# EAGLE design RGB_Station_v12 (EAGLE 8.7.0)
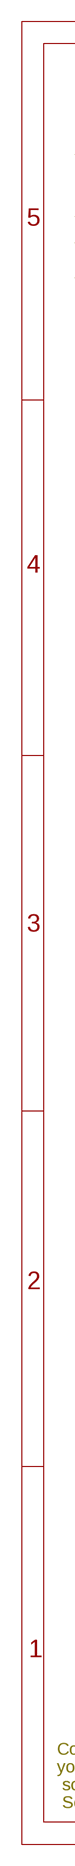
[diagram p0: schematic, sheet 1, part 1 of 2]
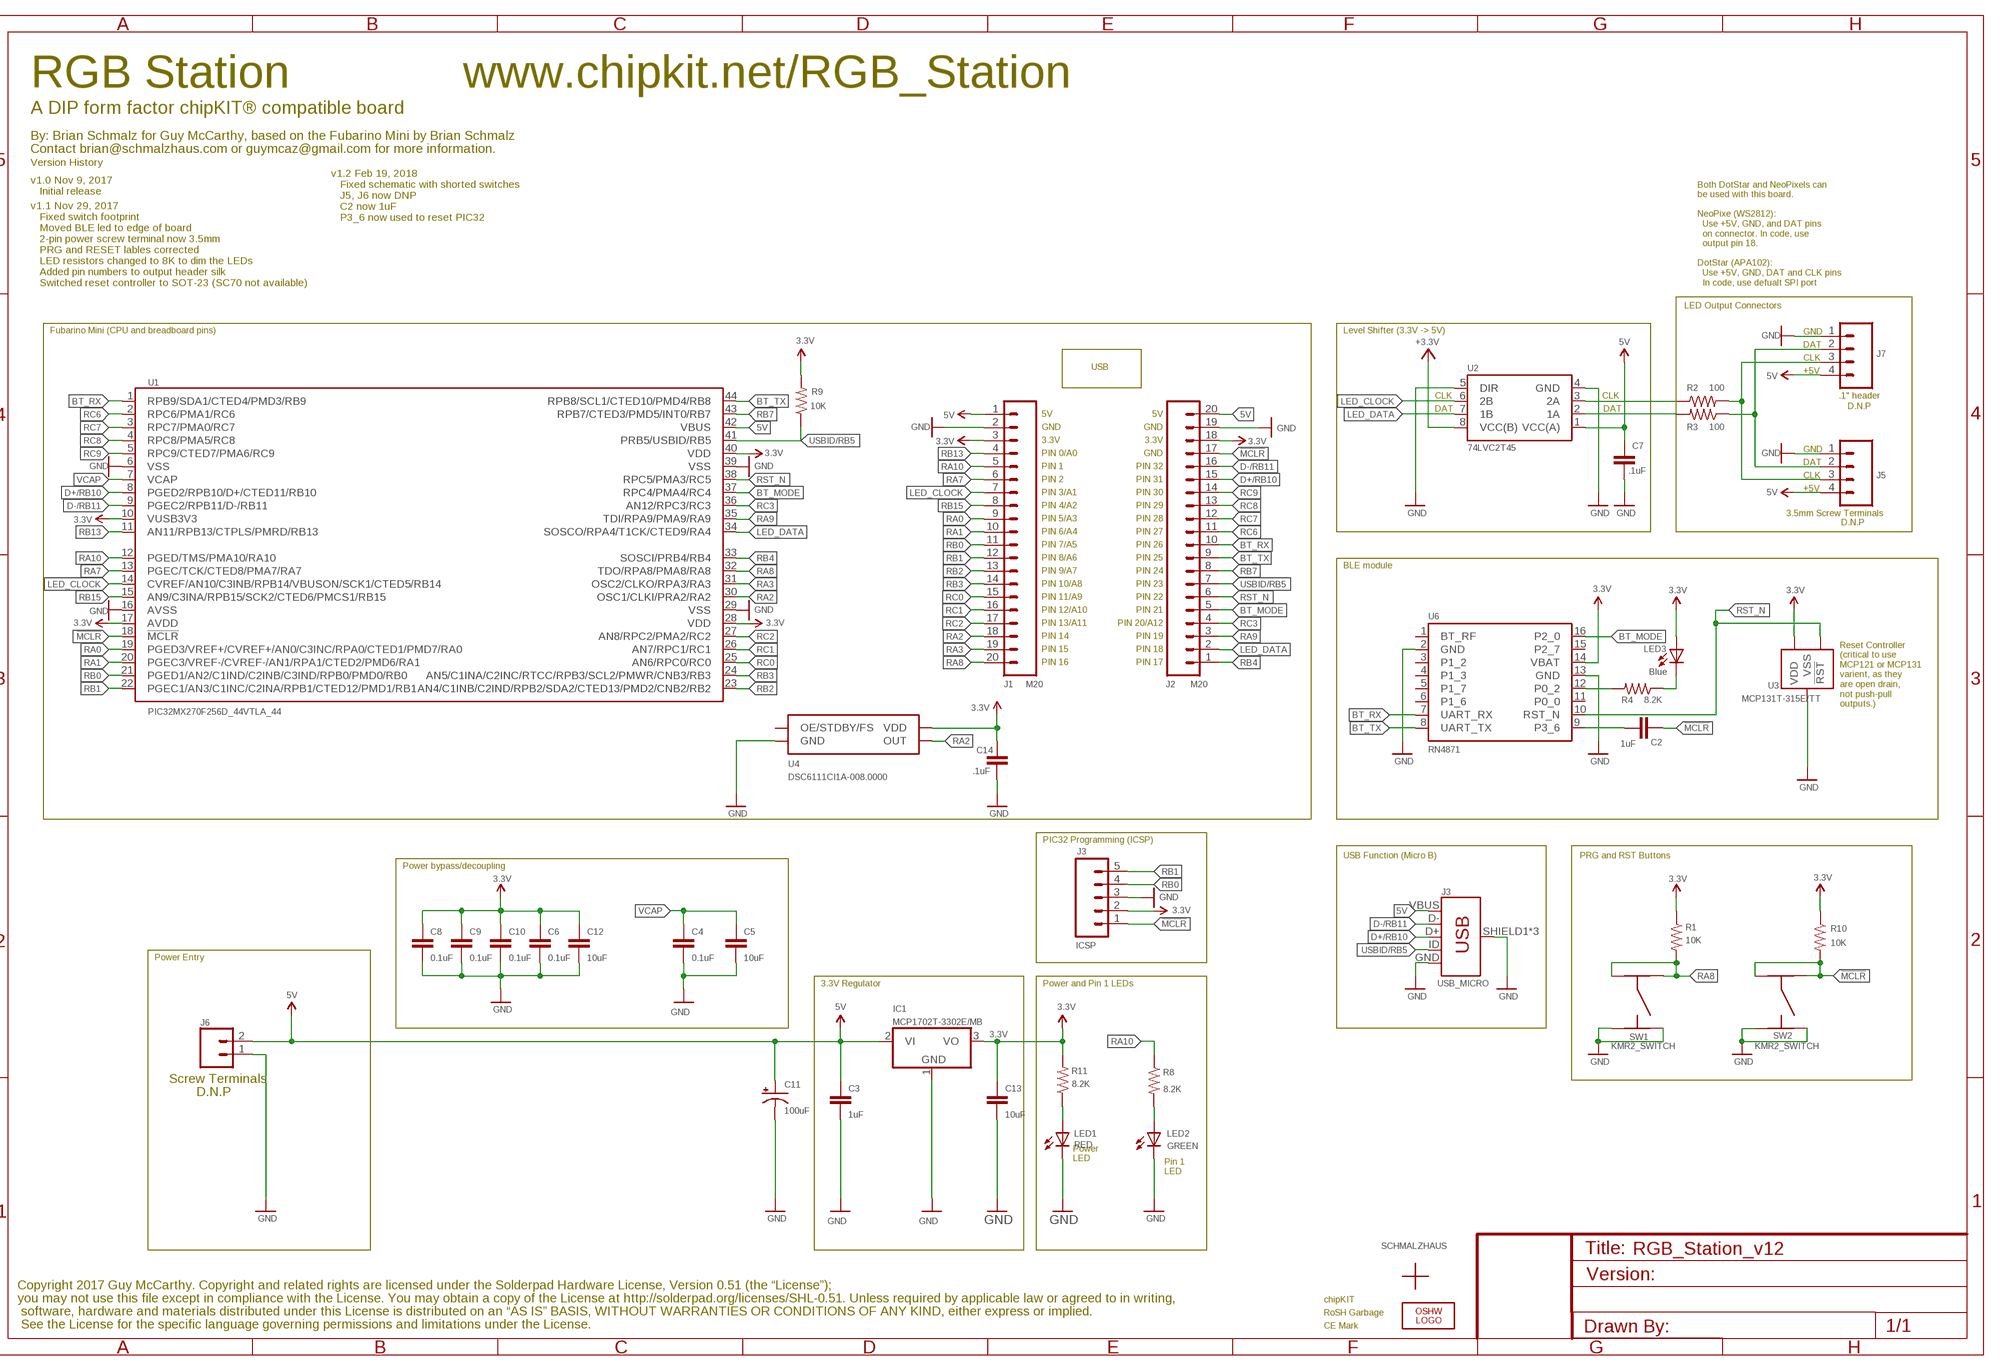
[diagram p1: schematic, sheet 1, part 2 of 2]

## Parts
C2  1uF  CAP0603-CAP  [0603-CAP]
C3  1uF  CAP0603-CAP  [0603-CAP]
C4  0.1uF  CAP0603-CAP  [0603-CAP]
C5  10uF  CAP0805  [0805]
C6  0.1uF  CAP0603  [0603]
C7  .1uF  CAP0603-CAP  [0603-CAP]
C8  0.1uF  CAP0603-CAP  [0603-CAP]
C9  0.1uF  CAP0603-CAP  [0603-CAP]
C10  0.1uF  CAP0603  [0603]
C11  100uF  CAP_POLC  [PANASONIC_C]
C12  10uF  CAP0805  [0805]
C13  10uF  CAP0805  [0805]
C14  .1uF  CAP0603-CAP  [0603-CAP]
IC1  MCP1702T-3302E/MB  RGB_STATION_V12_LINEAR_MCP170328MB  [RGB_STATION_V12_LINEAR_SOT89]
ICSP  J3  M05NOSLILK  [1X05_NOSILK]
J1  M20  [1X20_NO_PIN1]
J2  M20  [1X20_NO_PIN1]
J3  USB_MICRO  SPARKFUN-CONNECTORS_USB_MICRO-B_FEMALE-SMT  [SPARKFUN-CONNECTORS_USB-B-MICRO-SMD]
J5  CONN_04SCREW  [SCREWTERMINAL-3.5MM-4@1]
J6  CONN_023.5MM  [SCREWTERMINAL-3.5MM-2]
J7  M04PTH  [1X04]
LED1  RED  LED0603  [LED-0603]
LED2  GREEN  LED0603  [LED-0603]
LED3  Blue  LED0603  [LED-0603]
LOGO1  OSHW_LOGO_8MILX0070-NT  [OSHW_8X70_NOTEXT]
R1  10K  RESISTOR0603-RES  [0603-RES]
R2  100  RESISTOR0603  [0603-RES]
R3  100  RESISTOR0603  [0603-RES]
R4  8.2K  RESISTOR0603-RES  [0603-RES]
R8  8.2K  RESISTOR0603-RES  [0603-RES]
R9  10K  RESISTOR0603-RES  [0603-RES]
R10  10K  RESISTOR0603-RES  [0603-RES]
R11  8.2K  RESISTOR0603-RES  [0603-RES]
SW1  KMR2_SWITCH  [KMR2_SWITCH]
SW2  KMR2_SWITCH  [KMR2_SWITCH]
U1  PIC32MX270F256D_44VTLA_44  PIC32MX2XX_44QFN44  [QFN-44-8X8-NOPAD]
U2  74LVC2T45  [VSSOP8]
U3  MCP131T-315E/TT  MCP1X2_RESET_CONTROLLER  [SOT23-3]
U4  DSC6111CI1A-008.0000  DSC61XX  [CDFN-4_3.2X2.5]
U6  RN4871  [RN4871]
U$2  CE_MARK5MM  [CE_5MM]
U$3  ROSH_GARBAGE  [ROHS_GARBAGE_5MM]
U$4  CHIPKIT2MM  [CHIPKIT_2MM]
U$5  SCHMALZHAUSSCHMALZHAUS_SMALL  [SCHMALZHAUS_SMALL]

## Nets
3.3V: C6.1 C8.1 C9.1 C10.1 C12.1 C13.1 C14.2 IC1.3(VO) ICSP.2 J1.3 J2.18 LED3.A R1.1 R9.2 R10.1 R11.2 U1.10(VUSB3V3) U1.17(AVDD) U1.28(VDD) U1.40(VDD) U2.8(VCC(B)) U3.2(VDD) U4.P4(VDD) U6.14(VBAT) ; supply symbol labelled +3.3V
5V: C3.1 C7.2 C11.+ IC1.2(VI) IC1.2@1(VI1) J1.1 J2.20 J3.VBUS J5.4 J6.2 J7.4 U1.42(VBUS) U2.1(VCC(A))
!MCLR!: C2.2 ICSP.1 J2.17 R10.2 SW2.P1 SW2.P4 U1.18(!MCLR!)
BT_MODE: J2.5 U1.37(RPC4/PMA4/RC4) U6.16(P2_0)
BT_RX: J2.10 U1.1(RPB9/SDA1/CTED4/PMD3/RB9) U6.7(UART_RX)
BT_TX: J2.9 U1.44(RPB8/SCL1/CTED10/PMD4/RB8) U6.8(UART_TX)
D+/RB10: J2.15 J3.D+ U1.8(PGED2/RPB10/D+/CTED11/RB10)
D-/RB11: J2.16 J3.D- U1.9(PGEC2/RPB11/D-/RB11)
GND: C3.2 C4.2 C5.2 C6.2 C7.1 C8.2 C9.2 C10.2 C11.- C12.2 C13.2 C14.1 IC1.1(GND) ICSP.3 J1.2 J2.19 J3.GND J3.SHIELD1(SHIELD) J3.SHIELD2(SHIELD) J3.SHIELD3(SHIELD) J5.1 J6.1 J7.1 LED1.C LED2.C SW1.P2 SW1.P3 SW2.P2 SW2.P3 U1.6(VSS) U1.16(AVSS) U1.29(VSS) U1.39(VSS) U2.4(GND) U2.5(DIR) U3.3(VSS) U4.P2(GND) U6.2(GND) U6.13(GND)
LED_CLOCK: J1.7 U1.14(CVREF/AN10/C3INB/RPB14/VBUSON/SCK1/CTED5/RB14) U2.6(2B)
LED_DATA: J2.2 U1.34(SOSCO/RPA4/T1CK/CTED9/RA4) U2.7(1B)
N$1: R4.2 U6.12(P0_2)
N$2: J5.2 J7.2 R3.1
N$3: R3.2 U2.2(1A)
N$4: J5.3 J7.3 R2.2
N$5: LED3.C R4.1
N$6: LED1.A R11.1
N$7: C2.1 U6.9(P3_6)
N$11: LED2.A R8.2
N$23: R2.1 U2.3(2A)
RA0: J1.9 U1.19(PGED3/VREF+/CVREF+/AN0/C3INC/RPA0/CTED1/PMD7/RA0)
RA1: J1.10 U1.20(PGEC3/VREF-/CVREF-/AN1/RPA1/CTED2/PMD6/RA1)
RA2: J1.18 U1.30(OSC1/CLKI/PRA2/RA2) U4.P3(OUT)
RA3: J1.19 U1.31(OSC2/CLKO/RPA3/RA3)
RA7: J1.6 U1.13(PGEC/TCK/CTED8/PMA7/RA7)
RA8: J1.20 R1.2 SW1.P1 SW1.P4 U1.32(TDO/RPA8/PMA8/RA8)
RA9: J2.3 U1.35(TDI/RPA9/PMA9/RA9)
RA10: J1.5 R8.1 U1.12(PGED/TMS/PMA10/RA10)
RB0: ICSP.4 J1.11 U1.21(PGED1/AN2/C1IND/C2INB/C3IND/RPB0/PMD0/RB0)
RB1: ICSP.5 J1.12 U1.22(PGEC1/AN3/C1INC/C2INA/RPB1/CTED12/PMD1/RB1)
RB2: J1.13 U1.23(AN4/C1INB/C2IND/RPB2/SDA2/CTED13/PMD2/CNB2/RB2)
RB3: J1.14 U1.24(AN5/C1INA/C2INC/RTCC/RPB3/SCL2/PMWR/CNB3/RB3)
RB4: J2.1 U1.33(SOSCI/PRB4/RB4)
RB7: J2.8 U1.43(RPB7/CTED3/PMD5/INT0/RB7)
RB13: J1.4 U1.11(AN11/RPB13/CTPLS/PMRD/RB13)
RB15: J1.8 U1.15(AN9/C3INA/RPB15/SCK2/CTED6/PMCS1/RB15)
RC0: J1.15 U1.25(AN6/RPC0/RC0)
RC1: J1.16 U1.26(AN7/RPC1/RC1)
RC2: J1.17 U1.27(AN8/RPC2/PMA2/RC2)
RC3: J2.4 U1.36(AN12/RPC3/RC3)
RC6: J2.11 U1.2(RPC6/PMA1/RC6)
RC7: J2.12 U1.3(RPC7/PMA0/RC7)
RC8: J2.13 U1.4(RPC8/PMA5/RC8)
RC9: J2.14 U1.5(RPC9/CTED7/PMA6/RC9)
RST_N: J2.6 U1.38(RPC5/PMA3/RC5) U3.1(!RST!) U6.10(RST_N)
USBID/RB5: J2.7 J3.ID R9.1 U1.41(PRB5/USBID/RB5)
VCAP: C4.1 C5.1 U1.7(VCAP)
Unconnected: U4.P1(OE/STDBY/FS) U6.1(BT_RF) U6.3(P1_2) U6.4(P1_3) U6.5(P1_7) U6.6(P1_6) U6.11(P0_0) U6.15(P2_7)

## Notes on the sheet
- RGB Station | www.chipkit.net/RGB_Station
- A DIP form factor chipKIT® compatible board
- By: Brian Schmalz for Guy McCarthy, based on the Fubarino Mini by Brian Schmalz
- Contact brian@schmalzhaus.com or guymcaz@gmail.com for more information.
- Version History
- v1.0 Nov 9, 2017
     Initial release
- v1.2 Feb 19, 2018
     Fixed schematic with shorted switches
     J5, J6 now DNP
     C2 now 1uF
     P3_6 now used to reset PIC32
- v1.1 Nov 29, 2017
     Fixed switch footprint
     Moved BLE led to edge of board
     2-pin power screw terminal now 3.5mm
     PRG and RESET lables corrected
     LED resistors changed to 8K to dim the LEDs
     Added pin numbers to output header silk
     Switched reset controller to SOT-23 (SC70 not available)
- Both DotStar and NeoPixels can
  be used with this board.
  
  NeoPixe (WS2812):
    Use +5V, GND, and DAT pins
    on connector. In code, use
    output pin 18.
  
  DotStar (APA102):
    Use +5V, GND, DAT and CLK pins
    In code, use defualt SPI port
- LED Output Connectors
- Fubarino Mini (CPU and breadboard pins) | Level Shifter (3.3V -> 5V) | GND
- DAT
- CLK
- USB
- +5V
- CLK | CLK | .1" header
- 5V | DAT | DAT | D.N.P
- 5V
- GND
- GND
- 3.3V
- 3.3V
- GND | GND
- PIN 0/A0
- PIN 32
- DAT
- PIN 1
- PIN 31
- CLK
- PIN 2
- PIN 30 | +5V
- PIN 3/A1
- PIN 29
- PIN 4/A2
- PIN 28 | 3.5mm Screw Terminals
- PIN 5/A3
- PIN 27 | D.N.P
- PIN 6/A4
- PIN 26
- PIN 7/A5
- PIN 25
- PIN 8/A6
- PIN 24 | BLE module
- PIN 9/A7
- PIN 23
- PIN 10/A8
- PIN 22
- PIN 11/A9
- PIN 21
- PIN 12/A10
- PIN 20/A12
- PIN 13/A11
- PIN 19
- PIN 14
- PIN 18
- PIN 15
- PIN 17
- PIN 16
- Reset Controller
  (critical to use
  MCP121 or MCP131
  varient, as they
  are open drain,
  not push-pull
  outputs.)
- PIC32 Programming (ICSP)
- USB Function (Micro B) | PRG and RST Buttons
- Power bypass/decoupling
- Power Entry
- 3.3V Regulator | Power and Pin 1 LEDs
- Screw Terminals
- D.N.P
- Power 
  LED
- Pin 1 
  LED
- Copyright 2017 Guy McCarthy. Copyright and related rights are licensed under the Solderpad Hardware License, Version 0.51 (the “License”);
- you may not use this file except in compliance with the License. You may obtain a copy of the License at http://solderpad.org/licenses/SHL-0.51. Unless required by applicable law or agreed to in writing,
- software, hardware and materials distributed under this License is distributed on an “AS IS” BASIS, WITHOUT WARRANTIES OR CONDITIONS OF ANY KIND, either express or implied.
- See the License for the specific language governing permissions and limitations under the License.

## Library data of the parts
C2 C7 = SparkFun-Capacitors:CAP: Capacitor Standard 0603 ceramic capacitor, and 0.1" leaded capacitor.
C3 C4 C8 C9 C14 = SparkFun:CAP: Capacitor Standard 0603 ceramic capacitor, and 0.1" leaded capacitor.
C5 C12 = SchmalzHaus:CAP: Capacitor Standard 0603 ceramic capacitor, and 0.1" leaded capacitor.
C6 C10 C13 = SparkFun02-20-08:CAP: Capacitor Standard 0603 ceramic capacitor, and 0.1" leaded capacitor.
C11 = SparkFun-Capacitors:CAP_POL: Capacitor Polarized These are standard SMD and PTH capacitors. Normally 10uF, 47uF, and 100uF in electrolytic and tantalum varieties. Always verify the external diameter of the through hole cap, it varies with capacity, voltage, and manufacturer. The EIA devices should be standard.
IC1 = RGB_Station_v12_VREG:RGB_STATION_V12_LINEAR_MCP1703*: 250 mA, 16V, Low Quiescent Current LDO Regulator Source: http://ww1.microchip.com/downloads/en/DeviceDoc/22049b.pdf
ICSP = SchmalzHaus:M05: Header 5 Standard 5-pin 0.1" header. Use with straight break away headers (SKU : PRT-00116), right angle break away headers (PRT-00553), swiss pins (PRT-00743), machine pins (PRT-00117), and female headers (PRT-00115). Molex polarized connector foot print use with SKU : PRT-08230 with associated crimp pins and housings.
J1 J2 = SchmalzHaus:M20
J3 = RGB_Station_v12_USB_CONN:SPARKFUN-CONNECTORS_USB_MICRO-B: USB Type Micro-B Connector Male/female and PTH/SMT variants SparkFun Products: SparkFun microB USB Breakout <https://www.sparkfun.com/products/12035> SparkFun USB microB Plug Breakout <https://www.sparkfun.com/products/10031> SparkFun ESP8266 Thing <https://www.sparkfun.com/products/13231>; PROD_ID: CONN-11752
J5 = SparkFun-Connectors:CONN_04: Multi connection point. Often used as Generic Header-pin footprint for 0.1 inch spaced/style header connections On any of the 0.1 inch spaced packages, you can populate with these: Break Away Headers - Straight <https://www.sparkfun.com/products/116> (PRT-00116) Break Away Male Headers - Right Angle <https://www.sparkfun.com/products/553> (PRT-00553) Female Headers <https://www.sparkfun.com/products/115> (PRT-00115) Break Away Headers - Machine Pin <https://www.sparkfun.com/products/117> (PRT-00117) Break Away Female Headers - Swiss Machine Pin <https://www.sparkfun.com/products/743> (PRT-00743) For SCREWTERMINALS and SPRING TERMINALS visit here: Screw Terimnals on SparkFun.com <https://www.sparkfun.com/search/results?term=Screw+Terminals> (5mm/3.5mm/2.54mm spacing) This device is also useful as a general connection point to wire up your design to another part of your project. Our various solder wires solder well into these plated through hole pads. Hook-Up Wire - Assortment (Stranded, 22 AWG) <https://www.sparkfun.com/products/11375> (PRT-11375) Hook-Up Wire - Assortment (Solid Core, 22 AWG) <https://www.sparkfun.com/products/11367> (PRT-11367) View the entire wire category on our website here <https://www.sparkfun.com/categories/141> Special notes: Molex polarized connector foot print use with SKU : PRT-08231 with associated crimp pins and housings. 1MM SMD Version SKU: PRT-10208; PROD_ID: 2xCONN-08399; SF_ID: 2xPRT-08084
J6 = SparkFun-Connectors:CONN_02: Multi connection point. Often used as Generic Header-pin footprint for 0.1 inch spaced/style header connections On any of the 0.1 inch spaced packages, you can populate with these: Break Away Headers - Straight <https://www.sparkfun.com/products/116> (PRT-00116) Break Away Male Headers - Right Angle <https://www.sparkfun.com/products/553> (PRT-00553) Female Headers <https://www.sparkfun.com/products/115> (PRT-00115) Break Away Headers - Machine Pin <https://www.sparkfun.com/products/117> (PRT-00117) Break Away Female Headers - Swiss Machine Pin <https://www.sparkfun.com/products/743> (PRT-00743) For SCREWTERMINALS and SPRING TERMINALS visit here: Screw Terimnals on SparkFun.com <https://www.sparkfun.com/search/results?term=Screw+Terminals> (5mm/3.5mm/2.54mm spacing) This device is also useful as a general connection point to wire up your design to another part of your project. Our various solder wires solder well into these plated through hole pads. Hook-Up Wire - Assortment (Stranded, 22 AWG) <https://www.sparkfun.com/products/11375> (PRT-11375) Hook-Up Wire - Assortment (Solid Core, 22 AWG) <https://www.sparkfun.com/products/11367> (PRT-11367) View the entire wire category on our website here <https://www.sparkfun.com/categories/141> Special notes: Molex polarized connector foot print use with: PRT-08233 with associated crimp pins and housings. 2.54_SCREWTERM for use with PRT-10571. 3.5mm Screw Terminal footprints for PRT-08084 5mm Screw Terminal footprints for use with PRT-08432; PROD_ID: CONN-08399
J7 = SparkFun-Connectors:M04: Header 4 Standard 4-pin 0.1" header. Use with straight break away headers (SKU : PRT-00116), right angle break away headers (PRT-00553), swiss pins (PRT-00743), machine pins (PRT-00117), and female headers (PRT-00115). Molex polarized connector foot print use with SKU : PRT-08231 with associated crimp pins and housings. 1MM SMD Version SKU: PRT-10208; PROD_ID: CONN-09696
LED1-LED3 = SparkFun:LED: LEDs Standard schematic elements and footprints for 5mm, 3mm, 1206, and 0603 sized LEDs. 5mm - Spark Fun Electronics SKU : COM-00529 (and others)
LOGO1 = OSHW:OSHW_LOGO_8MIL
R1 R4 R8-R11 = SparkFun:RESISTOR: Resistor Basic schematic elements and footprints for 0603, 1206, and PTH resistors.
R2 R3 = SparkFun-Resistors:RESISTOR: Resistor Basic schematic elements and footprints for 0603, 1206, and PTH resistors.
SW1 SW2 = kmr2_switch:KMR2_SWITCH
U1 = SchmalzHaus:PIC32MX2XX_44
U2 = 74LVCH2T45DC:74LVC2T45
U3 = MCP1x2_ResetController:MCP1X2_RESET_CONTROLLER
U4 = DSC61XX:DSC61XX
U6 = RN4870-71:RN4871
U$2 = SchmalzHausPublic:CE_MARK
U$3 = SchmalzHausPublic:ROSH_GARBAGE
U$4 = SchmalzHausPublic:CHIPKIT
U$5 = SchmalzHaus:SCHMALZHAUS

## Board
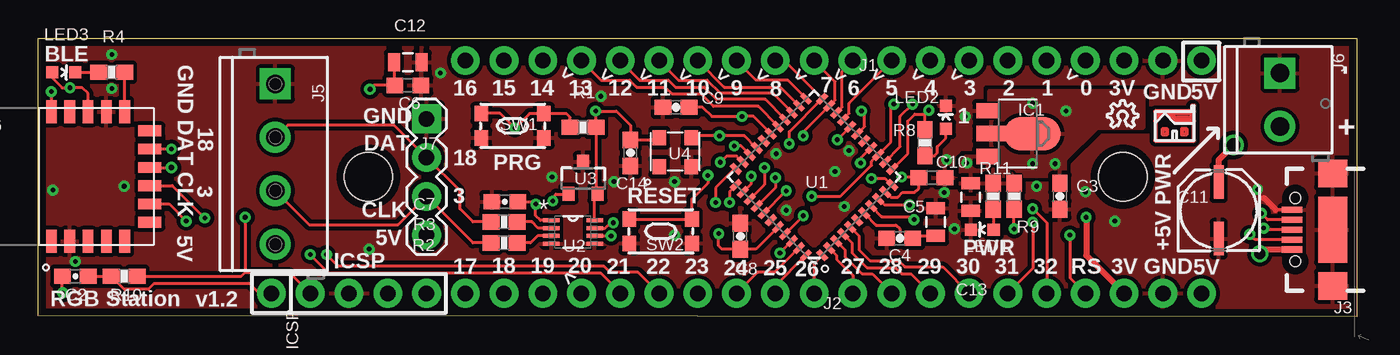
[diagram p2: board, top side]
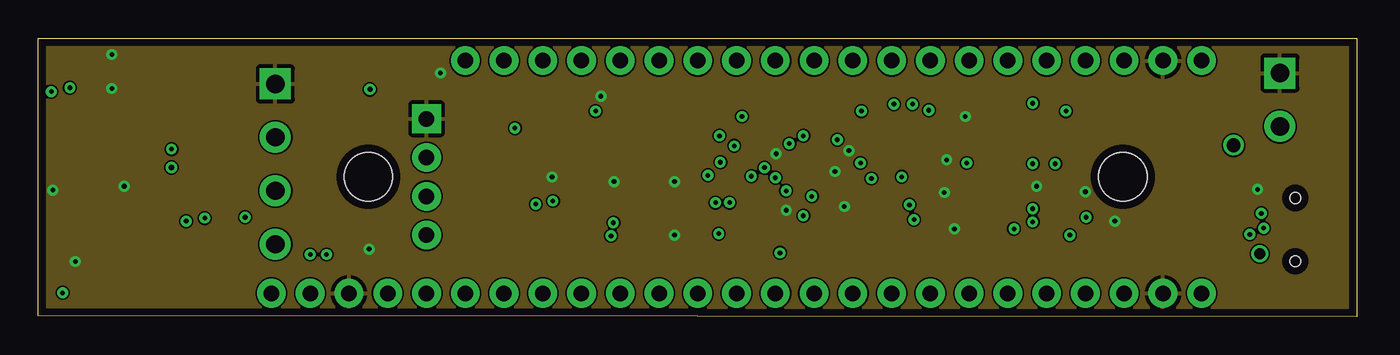
[diagram p3: board, inner layer Route2]
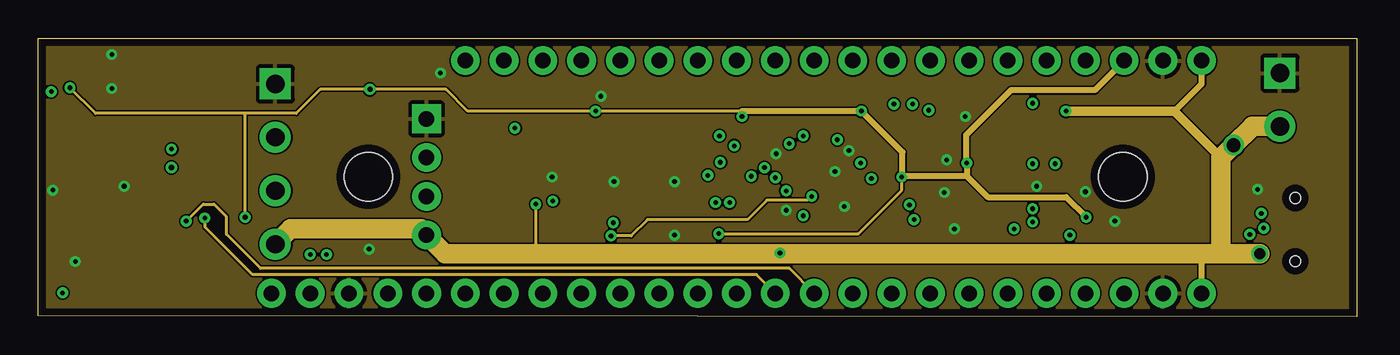
[diagram p4: board, inner layer Route15]
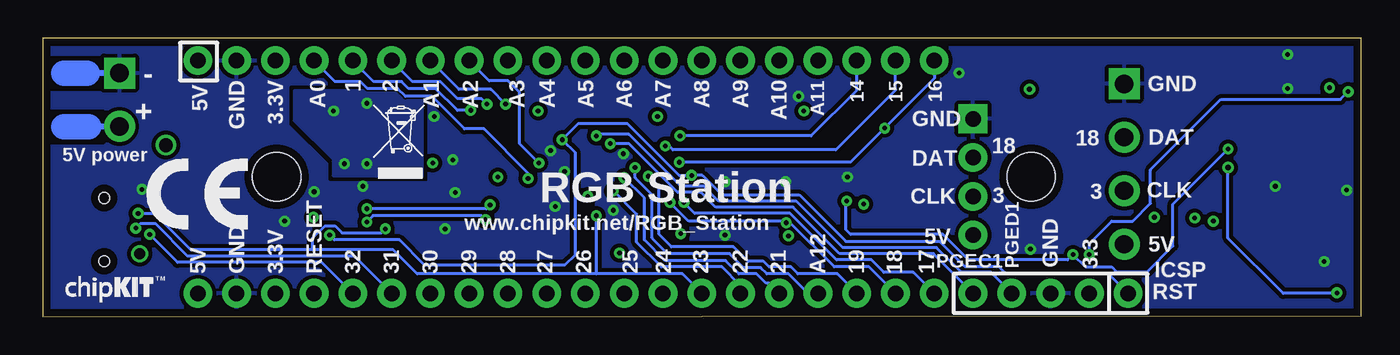
[diagram p5: board, bottom side, seen from below]

Size 86.41 x 18.24 mm. Coordinates in mm from the lower left corner, seen from the top.
Outline: 0,18.24 86.41,18.24 86.41,0 0,0.05 0,18.24
Copper layers (1*2*15*16): Top 0.035mm / dielectric 0.2mm / Route2 0.0175mm / dielectric 0.3mm / Route15 0.0175mm / dielectric 0.2mm / Bottom 0.035mm
Design rules "PCBNG_4layer": minimum track width 4mil, minimum drill 12mil, track to track 4mil, track to pad 4mil, pad to pad 4mil, via to via 4mil, smd to smd 0mil, copper to edge 20mil, drill to drill 8mil, minimum pad ring 8mil, minimum via ring 8mil, stop-mask expansion 4mil, vias tented up to drill 25mil, thermal gap 10mil
Holes 3.17 mm at 21.64,9.14 71.09,9.14
bRestrict: area 82.5,11.5 to 86.5,13.3; area 82.5,15 to 86.5,16.8

### Footprints (pad centres in the part's own frame; a part is rotated, then mirrored left to right if it is on the bottom)
0603-CAP = smd 1.1 x 1: 1 -0.85,0; 2 0.85,0
0805 = smd 0.8 x 1.2: 1 -0.9,0; 2 0.9,0
0603 = smd 1.1 x 1: 1 -0.85,0; 2 0.85,0
PANASONIC_C = smd 2.2 x 0.65: + 1.9,-0.2; - -1.8,-0.2
RGB_STATION_V12_LINEAR_SOT89 = smd 1 x 1.5: 1 -1.499,-1.981; 3 1.499,-1.981 | smd 1 x 2: 2 0,-1.727 | smd 2.2 x 3.7: 2@1 0,0.94
1X05_NOSILK = drill 1.016 pad 1.88: 1 0,0; 2 2.54,0; 3 5.08,0; 4 7.62,0; 5 10.16,0
1X20_NO_PIN1 = drill 1.016 pad 1.88: 1 -24.13,0; 2 -21.59,0; 3 -19.05,0; 4 -16.51,0; 5 -13.97,0; 6 -11.43,0; 7 -8.89,0; 8 -6.35,0; 9 -3.81,0; 10 -1.27,0; 11 1.27,0; 12 3.81,0; 13 6.35,0; 14 8.89,0; 15 11.43,0; 16 13.97,0; 17 16.51,0; 18 19.05,0; 19 21.59,0; 20 24.13,0
SPARKFUN-CONNECTORS_USB-B-MICRO-SMD = smd 1.35 x 0.4: D+ 2.675,0; D- 2.675,0.65; GND 2.675,-1.3; ID 2.675,-0.65; VBUS 2.675,1.3 | smd 1.9 x 1.8: SHIELD1 0,3.685; SHIELD2 0,-3.685 | smd 1.9 x 4.3: SHIELD3 0,0 | hole 0.7: 2.45,2.075; 2.45,-2.075
SCREWTERMINAL-3.5MM-4@1 = drill 1.2 pad 2.032 square: 1 0,0 | drill 1.2 pad 2.032: 2 3.5,0; 3 7,0; 4 10.5,0
SCREWTERMINAL-3.5MM-2 = drill 1.2 pad 2.032 square: 1 0,0 | drill 1.2 pad 2.032: 2 3.5,0
1X04 = drill 1.016 pad 1.88 square: 1 0,0 | drill 1.016 pad 1.88: 2 2.54,0; 3 5.08,0; 4 7.62,0
LED-0603 = smd 0.8 x 0.8: A 0,-0.75; C 0,0.75
0603-RES = smd 1.1 x 1: 1 -0.85,0; 2 0.85,0
KMR2_SWITCH = smd 0.9 x 1: P1 -2.05,0.8; P2 -2.05,-0.8; P3 2.05,-0.8; P4 2.05,0.8
QFN-44-8X8-NOPAD = smd 0.8 x 0.35: 1 -4,3.25; 2 -4,2.6; 3 -4,1.95; 4 -4,1.3; 5 -4,0.65; 6 -4,0; 7 -4,-0.65; 8 -4,-1.3; 9 -4,-1.95; 10 -4,-2.6; 11 -4,-3.25; 23 4,-3.25; 24 4,-2.6; 25 4,-1.95; 26 4,-1.3; 27 4,-0.65; 28 4,0; 29 4,0.65; 30 4,1.3; 31 4,1.95; 32 4,2.6; 33 4,3.25 | smd 0.35 x 0.8: 12 -3.25,-4; 13 -2.6,-4; 14 -1.95,-4; 15 -1.3,-4; 16 -0.65,-4; 17 0,-4; 18 0.65,-4; 19 1.3,-4; 20 1.95,-4; 21 2.6,-4; 22 3.25,-4; 34 3.25,4; 35 2.6,4; 36 1.95,4; 37 1.3,4; 38 0.65,4; 39 0,4; 40 -0.65,4; 41 -1.3,4; 42 -1.95,4; 43 -2.6,4; 44 -3.25,4
VSSOP8 = smd 1.067 x 0.254: 1 -1.422,0.762; 2 -1.422,0.254; 3 -1.422,-0.254; 4 -1.422,-0.762; 5 1.422,-0.762; 6 1.422,-0.254; 7 1.422,0.254; 8 1.422,0.762
SOT23-3 = smd 0.8 x 0.9: 1 -0.95,-1; 2 0.95,-1; 3 0,1.1
CDFN-4_3.2X2.5 = smd 1 x 0.9: P1 -0.95,1.05; P2 -0.95,-1.05; P3 0.95,-1.05; P4 0.95,1.05
RN4871 = smd 1.5 x 0.7: 1 -4.25,0.95; 2 -4.25,-0.25; 3 -4.25,-1.45; 4 -4.25,-2.65; 5 -4.25,-3.85; 12 4.25,-3.85; 13 4.25,-2.65; 14 4.25,-1.45; 15 4.25,-0.25; 16 4.25,0.95 | smd 0.7 x 1.5: 6 -3,-5.5; 7 -1.8,-5.5; 8 -0.6,-5.5; 9 0.6,-5.5; 10 1.8,-5.5; 11 3,-5.5

### Placement (x,y rotation side)
C2  2.44,2.64 0 top
C3  66.95,7.87 270 top
C4  56.46,5.13 180 top
C5  58.83,6.2 90 top
C6  24.23,15.14 0 top
C7  30.58,7.52 0 top
C8  46.02,5.25 90 top
C9  41.81,13.72 180 top
C10  58.57,9.09 0 top
C11  77.17,6.91 90 top
C12  24.23,16.66 0 top
C13  61.11,7.82 270 top
C14  38.81,10.72 90 top
IC1  64.21,11.99 270 top
ICSP  15.29,1.52 0 top
J1  52.12,16.76 180 top
J2  52.12,1.52 0 top
J3  84.84,5.69 180 top
J5  15.54,15.24 270 top
J6  81.38,15.95 270 top
J7  25.45,12.95 270 top
LED1  61.87,5.69 90 top
LED2  59.49,13.06 0 top
LED3  1.68,16 270 top
LOGO1  70.08,12.39 0 top
R1  35.71,12.4 180 top
R2  30.53,4.83 180 top
R3  30.53,6.2 0 top
R4  4.83,16 0 top
R8  58.12,11.38 270 top
R9  63.96,7.87 90 top
R10  5.64,2.64 180 top
R11  62.59,7.87 90 top
SW1  31.09,12.5 0 top
SW2  40.79,5.59 0 top
U1  50.85,9.14 135 top
U2  35.05,5.54 0 top
U3  35.71,9.04 0 top
U4  41.76,10.77 90 top
U6  1.82,9.17 90 top
U$2  76.28,8.09 0 bottom
U$3  64.72,9.03 0 bottom
U$4  85.04,0.9 0 bottom
U$5  74.47,11.53 0 top

### Tracks (layer width: path | path; a pad name or v marks a point on that pad's centre or on a via)
3.3V  (via drill 0.3, 0.33)
  Top 0.203: U1.10 55.55,8.15 55.88,7.82 56.34,7.82 56.64,8.13 57.45,8.13 57.71,8.38 57.71,9.08 C10.1 57.67,9.14 v56.59,9.14 | U1.28 46.89,13.11 v46.13,13.11 44.14,13.11 43.54,13.72 C9.1 | U1.40 47.04,4.42 46.03,4.42 | U1.17 54.15,12.45 54.15,13.26 v53.95,13.46 | 46.03,4.42 C8.1 | 46.03,4.42 44.81,4.42 44.6,4.62 v44.6,5.44 | 13.56,2.9 16.46,2.9 ICSP.2 | v13.56,6.5 13.56,2.9 | U2.8 36.47,7.77 36.58,7.77 36.66,7.86 U3.2 36.58,8.13 36.58,12.38 R1.1 36.53,12.42 v36.53,13.46 37.9,13.46 38.81,12.55 C14.2 39,11.57 39.01,11.58 40.57,11.58 U4.P4 | R10.1 13.31,2.64 13.56,2.9 | C12.1 23.33,15.19 C6.1 22,15.14 v21.74,14.88 | U6.14 3.27,14.61 2.9,14.99 v2.08,14.99 1.57,14.99 0.93,15.63 LED3.A
  Top 0.406: v68.68,6.5 68.68,4.01 J2.18
  Route15 0.203: 46.13,13.46 v36.53,13.46 28.14,13.46 26.72,14.88 v21.74,14.88 18.49,14.88 16.92,13.31 13.55,13.31 | 13.55,13.31 3.76,13.31 v2.08,14.99 | 13.55,13.31 13.55,6.52 v13.56,6.5 | v44.6,5.44 53.75,5.44 56.59,8.28 v56.59,9.14
  Route15 0.406: J1.3 69.24,14.83 63.75,14.83 60.81,11.89 60.81,10.11 v60.86,10.06 60.86,9.2 | 60.86,9.2 62.23,7.82 67.36,7.82 v68.68,6.5 | 60.86,9.2 56.64,9.2 | 56.64,9.2 v56.59,9.14 | 56.64,9.2 56.64,10.77 v53.95,13.46 46.13,13.46 v46.13,13.11
  pour Top: 60.76,10.52 60.4,10.16 60.4,8.23 64.01,8.23 64.01,9.19 63.65,9.55 62.84,9.55 62.59,9.8 62.59,10.11 62.18,10.52
5V  (via drill 0.3, 0.7, 0.9)
  Top 0.203: C7.2 32.46,7.52 v32.61,7.37 32.61,6.6 32.92,6.3 U2.1 | U1.42 49.4,4.95 v48.62,4.17
  Top 0.406: C11.+ 77.36,10.26 v78.33,11.23 | J3.VBUS 80.34,4.39 v80.06,4.12
  Route15 0.203: v32.61,7.37 32.61,4.12 32.56,4.12 | v48.62,4.17 48.62,4.12
  Route15 0.254: 79.55,12.45 79.56,12.45
  Route15 0.406: 74.47,13.46 76.25,15.24 J1.1 | J2.20 76.25,4.12 | 77.52,10.31 77.52,10.41
  Route15 0.61: 77.52,10.41 74.47,13.46 v67.36,13.46
  Route15 1.27: 77.52,10.31 77.52,4.12 | 77.52,4.12 76.25,4.12 48.62,4.12 32.56,4.12 26.67,4.12 J7.4 25.45,5.38 25.09,5.74 16.54,5.74 J5.4 | 77.52,4.12 v80.06,4.12 | 77.52,10.41 v78.33,11.23 79.55,12.45 79.56,12.45 J6.2
  Bottom 0.406: J6.2 83.41,12.45
  Bottom 1.676: 83.41,12.45 85.04,12.45
  other vias: 66.65,10.01 65.18,13.97 65.18,10.01
  pour Top (rank 3): 62.33,9.19 67.36,9.19 67.36,10.26 69.44,12.34 72.44,12.34 72.49,12.4 72.49,14.78 62.28,14.78
  pour Bottom: 61.57,14.83 61.57,9.14 67.36,9.19 67.36,10.26 69.9,12.8 69.9,14.83
!MCLR!  (via drill 0.3)
  Top 0.203: v52.37,11.58 v52.37,11.59 U1.18 | v67.61,5.33 67.61,2.54 J2.17 | v43.89,9.25 43.89,8.74 42.84,7.69 SW2.P4 SW2.P1 | C2.2 R10.2 5.65,1.78 7.21,1.78 7.57,2.13 13.87,2.13 14.48,1.52 ICSP.1
  Bottom 0.203: v67.61,5.33 67.31,5.03 63.04,5.03 61.42,3.4 52.17,3.4 51.51,4.06 51.51,10.72 v52.37,11.58 51.31,12.65 48.11,12.65 44.7,9.25 v43.89,9.25 43.18,9.25 41.91,7.98 36.83,7.98 33.78,4.93 27.63,4.93 26.01,3.3 23.77,3.3 23.32,2.85 16.61,2.85 ICSP.1
BT_MODE  (via drill 0.3)
  Top 0.203: v48.31,9.09 48.31,8.43 47.11,7.23 U1.37 | J2.5 38.15,1.57 36.88,2.85 19.05,2.85 v17.83,4.06 | v0.86,14.73 U6.16
  Bottom 0.203: J2.5 38.81,2.18 39.01,2.18 39.62,2.79 40.79,2.79 41.66,3.66 45.62,3.66 46.99,5.03 46.99,7.77 v48.31,9.09 | v17.83,4.06 17.83,4.78 16.36,6.25 14.99,6.25 13.82,7.42 13.82,9.6 9.19,14.22 1.37,14.22 v0.86,14.73
BT_RX  (via drill 0.3)
  Top 0.203: 51.41,4.02 51.41,4.01 51.38,3.98 | 51.38,3.98 50.85,3.45 J2.10 | U6.7 8.58,7.37 v9.7,6.25 | U1.1 51.38,3.98
  Route15 0.203: J2.10 49.22,3.15 14.58,3.15 12.34,5.38 12.34,6.55 11.53,7.37 10.82,7.37 v9.7,6.25
BT_TX  (via drill 0.3)
  Top 0.203: J2.9 48.31,2.03 50.21,3.93 50.32,3.93 U1.44 | U6.8 8.8,8.57 v10.92,6.45
  Route15 0.203: J2.9 47.09,2.74 14.07,2.74 10.92,5.89 v10.92,6.45
D+/RB10  (via drill 0.3)
  Top 0.203: U1.8 55.27,6.55 57.2,6.55 v57.4,6.35 | J3.D+ 80.42,5.69 v80.31,5.79 | v65.18,6.2 65.18,3.15 J2.15
  Bottom 0.203: v57.4,6.35 57.66,6.6 64.77,6.6 v65.18,6.2 | v80.31,5.79 80.01,6.1 79.04,6.1 76.91,3.96 65.99,3.96 J2.15
D-/RB11  (via drill 0.3)
  Top 0.203: U1.9 55.09,7.69 55.47,7.31 v57.1,7.31 | J3.D- 79.75,5.04 v79.4,5.38 | v65.18,7.06 66.09,6.15 J2.16
  Bottom 0.203: v57.1,7.31 57.35,7.06 v65.18,7.06 | v79.4,5.38 77.57,3.56 68.12,3.56 J2.16
GND  (via drill 0.3)
  Top 0.203: J3.GND 81.1,6.99
  Top 0.406: 81.1,6.99 80.31,7.77
  Bottom 0.406: J6.1 83.51,15.95
  Bottom 1.676: 83.51,15.95 85.04,15.95
  other vias: 52.83,7.21 53.14,10.87 49.02,6.96 48.36,10.67 59.39,8.13 60.05,5.74 70.56,6.25 79.91,8.33 68.63,8.18 65.43,8.53 60.76,13.11 59.54,10.26 5.64,8.53 4.83,14.94 4.83,17.17 2.44,3.61 0.97,8.28 36.88,14.43 41.71,5.33 33.68,9.14 52.22,9.5 21.69,4.42 37.74,8.84 41.71,8.84 26.37,15.95
  pour Top (isolate 0.254, rank 6): -0.1,18.19 -0.1,0.1 86.56,0.1 86.56,18.19
  pour Route2: -0.05,18.14 86.51,18.14 86.56,0.1 -0.05,0.15
  pour Route15: -0.05,18.14 86.51,18.14 86.56,0.1 -0.05,0.15
  pour Bottom (isolate 0.254, rank 3): -0.05,0.15 -0.05,18.14 86.51,18.14 86.56,0.1
LED_CLOCK  (via drill 0.3)
  Top 0.203: v56.08,13.92 55.88,13.72 55.88,11.43 55.06,10.61 U1.14 55.04,10.59 54.61,10.16 54.61,9.91 52.58,7.87 v50.7,7.87 | U2.6 v37.54,5.28
  Route15 0.203: v50.7,7.87 50.44,7.62 47.75,7.62 46.48,6.35 39.93,6.35 38.86,5.28 v37.54,5.28
  Bottom 0.203: v56.08,13.92 57.05,14.88 59.13,14.88 J1.7
LED_DATA  (via drill 0.3)
  Top 0.203: U1.34 45.72,8.59 45.31,8.18 v45.31,7.47 | U2.7 37.16,5.79 37.51,6.15 v37.69,6.15
  Bottom 0.203: J2.2 32.26,3.25 34.54,3.25 37.44,6.15 v37.69,6.15 37.79,6.25 44.09,6.25 v45.31,7.47
N$1
  Top 0.203: U6.12 5.67,15.99 R4.2
N$2
  Top 0.203: R3.1 28.5,6.2 27.63,7.06 27.63,8.23 J7.2 23.32,12.55 16.35,12.55 J5.2
N$3
  Top 0.203: U2.2 32.77,5.79 32.36,6.2 R3.2
N$4
  Top 0.203: R2.2 28.5,4.83 J7.3 23.57,5.99 17.79,5.99 J5.3
N$5
  Top 0.203: LED3.C R4.1
N$6
  Top 0.203: R11.1 62.59,5.73 LED1.A
N$7  (via drill 0.3, 0.35)
  Top 0.203: C2.1 1.59,1.54 v1.6,1.55 | U6.9 7.34,9.75 v8.74,9.75
  Bottom 0.203: v1.6,1.55 1.63,1.52 5.13,1.52 8.74,5.13 v8.74,9.75
N$11
  Top 0.203: R8.2 58.74,10.53 58.93,10.72 58.93,11.12 59.49,11.68 LED2.A
N$23
  Top 0.203: U2.3 32.71,5.28 32.26,4.83 R2.1
RA0
  Top 0.203: U1.19 52.76,12.93 53.14,13.31 53.14,13.97 J1.9
RA1
  Top 0.203: U1.20 52.31,13.35 52.68,13.72 52.68,16.05 J1.10
RA2  (via drill 0.3)
  Top 0.203: U1.30 47.05,11.06 46.28,11.84 v44.65,11.84 42.92,11.84 U4.P3
  Bottom 0.203: v44.65,11.84 36.07,11.84 33.07,14.83 J1.18
RA3  (via drill 0.3)
  Top 0.203: U1.31 46.06,11.18 v45.62,11.18
  Bottom 0.203: J1.19 30.53,14.83 34.44,10.92 45.11,10.92 45.36,11.18 v45.62,11.18
RA7  (via drill 0.3)
  Top 0.203: U1.13 55.52,10.15 56.49,11.12 56.49,13.11 v57.3,13.92
  Bottom 0.203: v57.3,13.92 57.66,14.28 59.23,14.28 60.35,15.39 62.18,15.39 J1.6
RA8  (via drill 0.3)
  Top 0.203: U1.32 46.15,10.13 45.77,10.52 45.11,10.52 v44.7,10.11 | 34.76,12.5 R1.2 34.86,13.04 34.59,13.31 34.58,13.3 SW1.P4 32.19,13.3 v31.24,12.34 30.28,13.31 29.05,13.31 SW1.P1
  Bottom 0.203: v44.7,10.11 33.48,10.11 v31.24,12.34 27.99,15.6 J1.20
RA9  (via drill 0.3)
  Top 0.203: U1.35 46.2,8.15 46.74,8.69 v46.74,9.2
  Bottom 0.203: J2.3 34.34,2.79 36.93,2.79 37.39,3.25 38.81,3.25 39.17,3.61 40.18,3.61 41.15,4.57 45.21,4.57 46.02,5.38 46.02,8.48 v46.74,9.2
RA10  (via drill 0.3)
  Top 0.203: U1.12 56,9.67 57,10.67 57,12.8 57.45,13.26 58.11,13.26 | R8.1 58.11,13.26 | 58.11,13.26 v58.37,13.51
  Bottom 0.203: v58.37,13.51 59.23,13.51 60.65,14.93 62.43,14.93 62.89,15.39 64.72,15.39 J1.5
RB0  (via drill 0.3)
  Top 0.203: J1.11 52.22,15.39 52.22,14.17 51.86,13.81 U1.21 51.84,13.79 50.14,12.09 v50.14,11.84
  Bottom 0.203: v50.14,11.84 50.04,11.94 48.01,11.94 44.6,8.53 43.08,8.53 42.11,7.57 37.03,7.57 33.98,4.52 27.84,4.52 26.21,2.9 24.28,2.9 ICSP.4
RB1  (via drill 0.3)
  Top 0.203: J1.12 48.92,16.76 51.38,14.3 U1.22 49.22,12.12 v49.22,11.33
  Bottom 0.203: v49.22,11.33 48.01,11.33 44.81,8.13 43.28,8.13 42.32,7.16 37.24,7.16 34.19,4.12 28.04,4.12 ICSP.5
RB2
  Top 0.203: U1.23 50.32,14.3 49.12,15.49 47.04,15.49 J1.13
RB3
  Top 0.203: J1.14 44.96,15.04 48.63,15.04 U1.24
RB4  (via drill 0.3)
  Top 0.203: U1.33 45.64,9.67 44.4,8.43 v44.4,7.47
  Bottom 0.203: J2.1 29.36,2.9 31.29,2.9 32.11,3.71 34.39,3.71 37.44,6.76 43.69,6.76 v44.4,7.47
RB7
  Top 0.203: U1.43 49.86,4.45 49.81,4.45 48.26,2.9 47.14,2.9 J2.8
RB13  (via drill 0.3)
  Top 0.203: U1.11 55.95,8.61 55.52,9.04 v54.61,9.04
  Bottom 0.203: J1.4 67.26,15.39 65.58,15.39 65.13,14.93 63.14,14.93 62.64,14.43 60.91,14.43 58.78,12.29 57.51,12.29 54.61,9.4 v54.61,9.04
RB15  (via drill 0.3)
  Top 0.203: v53.9,10.06 53.9,10.36 54.59,11.05 U1.15
  Bottom 0.203: v53.9,10.06 55.17,11.33 55.17,14.68 55.93,15.44 57.15,15.44 J1.8
RC0
  Top 0.203: J1.15 41.96,15.49 43.84,15.49 44.7,14.63 48.16,14.63 49.4,13.39 U1.25
RC1
  Top 0.203: J1.16 39.42,15.49 41.3,15.49 41.76,15.04 43.64,15.04 44.45,14.22 47.65,14.22 48.94,12.93 U1.26
RC2
  Top 0.203: J1.17 36.88,15.49 38.76,15.49 39.22,15.04 41.1,15.04 41.55,14.58 43.43,14.58 44.25,13.77 47.19,13.77 48.48,12.48 U1.27
RC3  (via drill 0.3)
  Top 0.203: v47.6,9.75 47.6,8.64 46.66,7.69 U1.36
  Bottom 0.203: J2.4 36.27,1.52 37.54,2.79 38.96,2.79 39.37,3.2 40.49,3.2 41.4,4.12 45.47,4.12 46.48,5.13 46.48,7.98 47.6,9.09 v47.6,9.75
RC6
  Top 0.203: U1.2 51.86,4.48 52.32,4.01 52.32,3.76 53.39,2.69 J2.11
RC7
  Top 0.203: J2.12 54.66,2.79 54,2.79 52.88,3.91 52.88,4.37 52.31,4.94 U1.3
RC8
  Top 0.203: J2.13 57.2,2.79 56.59,2.79 56.18,3.2 54.3,3.2 53.34,4.17 53.34,4.83 U1.4
RC9
  Top 0.203: J2.14 59.28,3.25 56.79,3.25 56.39,3.66 54.51,3.66 53.8,4.37 53.8,5.28 U1.5
RST_N  (via drill 0.3)
  Top 0.203: U1.38 v49.02,8.23 | J2.6 39.32,2.9 37.49,2.9 37.08,3.3 19.66,3.3 v18.9,4.06 | v8.74,10.97 U6.10 | v33.73,7.57 33.73,7.82 33.93,8.03 34.75,8.03 U3.1
  Bottom 0.203: v49.02,8.23 47.5,6.71 47.5,4.88 45.87,3.25 41.91,3.25 40.69,2.03 J2.6 | v8.74,10.97 12.34,7.37 12.34,4.62 14.02,2.95 16.05,2.95 16.36,3.25 18.08,3.25 v18.9,4.06 19.25,3.71 25.76,3.71 27.43,5.38 33.48,5.38 33.78,5.69 33.78,7.52 v33.73,7.57
USBID/RB5  (via drill 0.3)
  Top 0.203: U1.41 48.94,5.41 v50.14,6.6 | J3.ID 80.58,6.34 v80.16,6.76 | v63.96,5.74 R9.1
  Bottom 0.203: J2.7 44.5,2.79 50.14,2.79 | 50.14,2.79 61.87,2.79 63.45,4.37 68.71,4.37 | 68.71,4.37 76.71,4.37 79.1,6.76 v80.16,6.76 | v50.14,6.6 50.14,2.79 | 68.71,4.37 68.71,5.15 67.92,5.94 67.26,5.94 66.8,5.49 64.21,5.49 v63.96,5.74
VCAP
  Top 0.203: U1.7 54.91,5.99 56.21,5.99 56.46,5.74 56.46,5.38 56.67,5.18 57.24,5.18 57.25,5.2 | 56.95,5.2 57.25,5.2 | 57.37,5.2 57.45,5.28 58.81,5.28 C5.1 | 57.25,5.2 57.37,5.2 | 57.37,5.2 57.38,5.2 C4.1

### Text on the board
tPlace: BLE | GND | ^ | ^ | ^ | ^ | ^ | ^ | ^ | ^ | ^ | ^ | ^ | ^ | - | 16 | 15 | 14 | 13 | 12 | 11 | 10 | 9 | 8 | 7 | 6 | 5 | 4 | 3 | 2 | 1 | 0 | 3V | GND | 5V | DAT | 18 | GND | 1 | DAT | + | 18 | CLK | PRG | 3 | 3 | RESET | CLK | 5V | 5V | PWR | +5V PWR | ICSP | 17 | 18 | 19 | 20 | 21 | 22 | 23 | 27 | 28 | 29 | 30 | 31 | 32 | RS | 3V | GND | ^ | 24 | 25 | 26 | 5V | RGB Station | v1.2
bPlace: GND | 16 | 15 | 14 | A11 | A10 | A9 | A8 | A7 | A6 | A5 | A4 | A3 | A2 | A1 | 2 | 1 | A0 | 3.3V | GND | 5V | - | GND | + | DAT | 18 | 5V power | 18 | DAT | CLK | 3 | 3 | CLK | RGB Station | www.chipkit.net/RGB_Station | 5V | PGEC1 | 5V | 3.3 | GND | PGED1 | 17 | 18 | 19 | A12 | 21 | 22 | 23 | 24 | 25 | 26 | 27 | 28 | 29 | 30 | 31 | 32 | RESET | 3.3V | GND | 5V | RST | ICSP